# EasyEDA schematic 原理图源工程：MQ系列气体传感器板.json
TITLE: MQ系列气体传感器板; REV: 1.0; Date: 2023-02-20; Sheet: 1/1; Drawn By: leelsp; Company: 工训A413+青禾之道
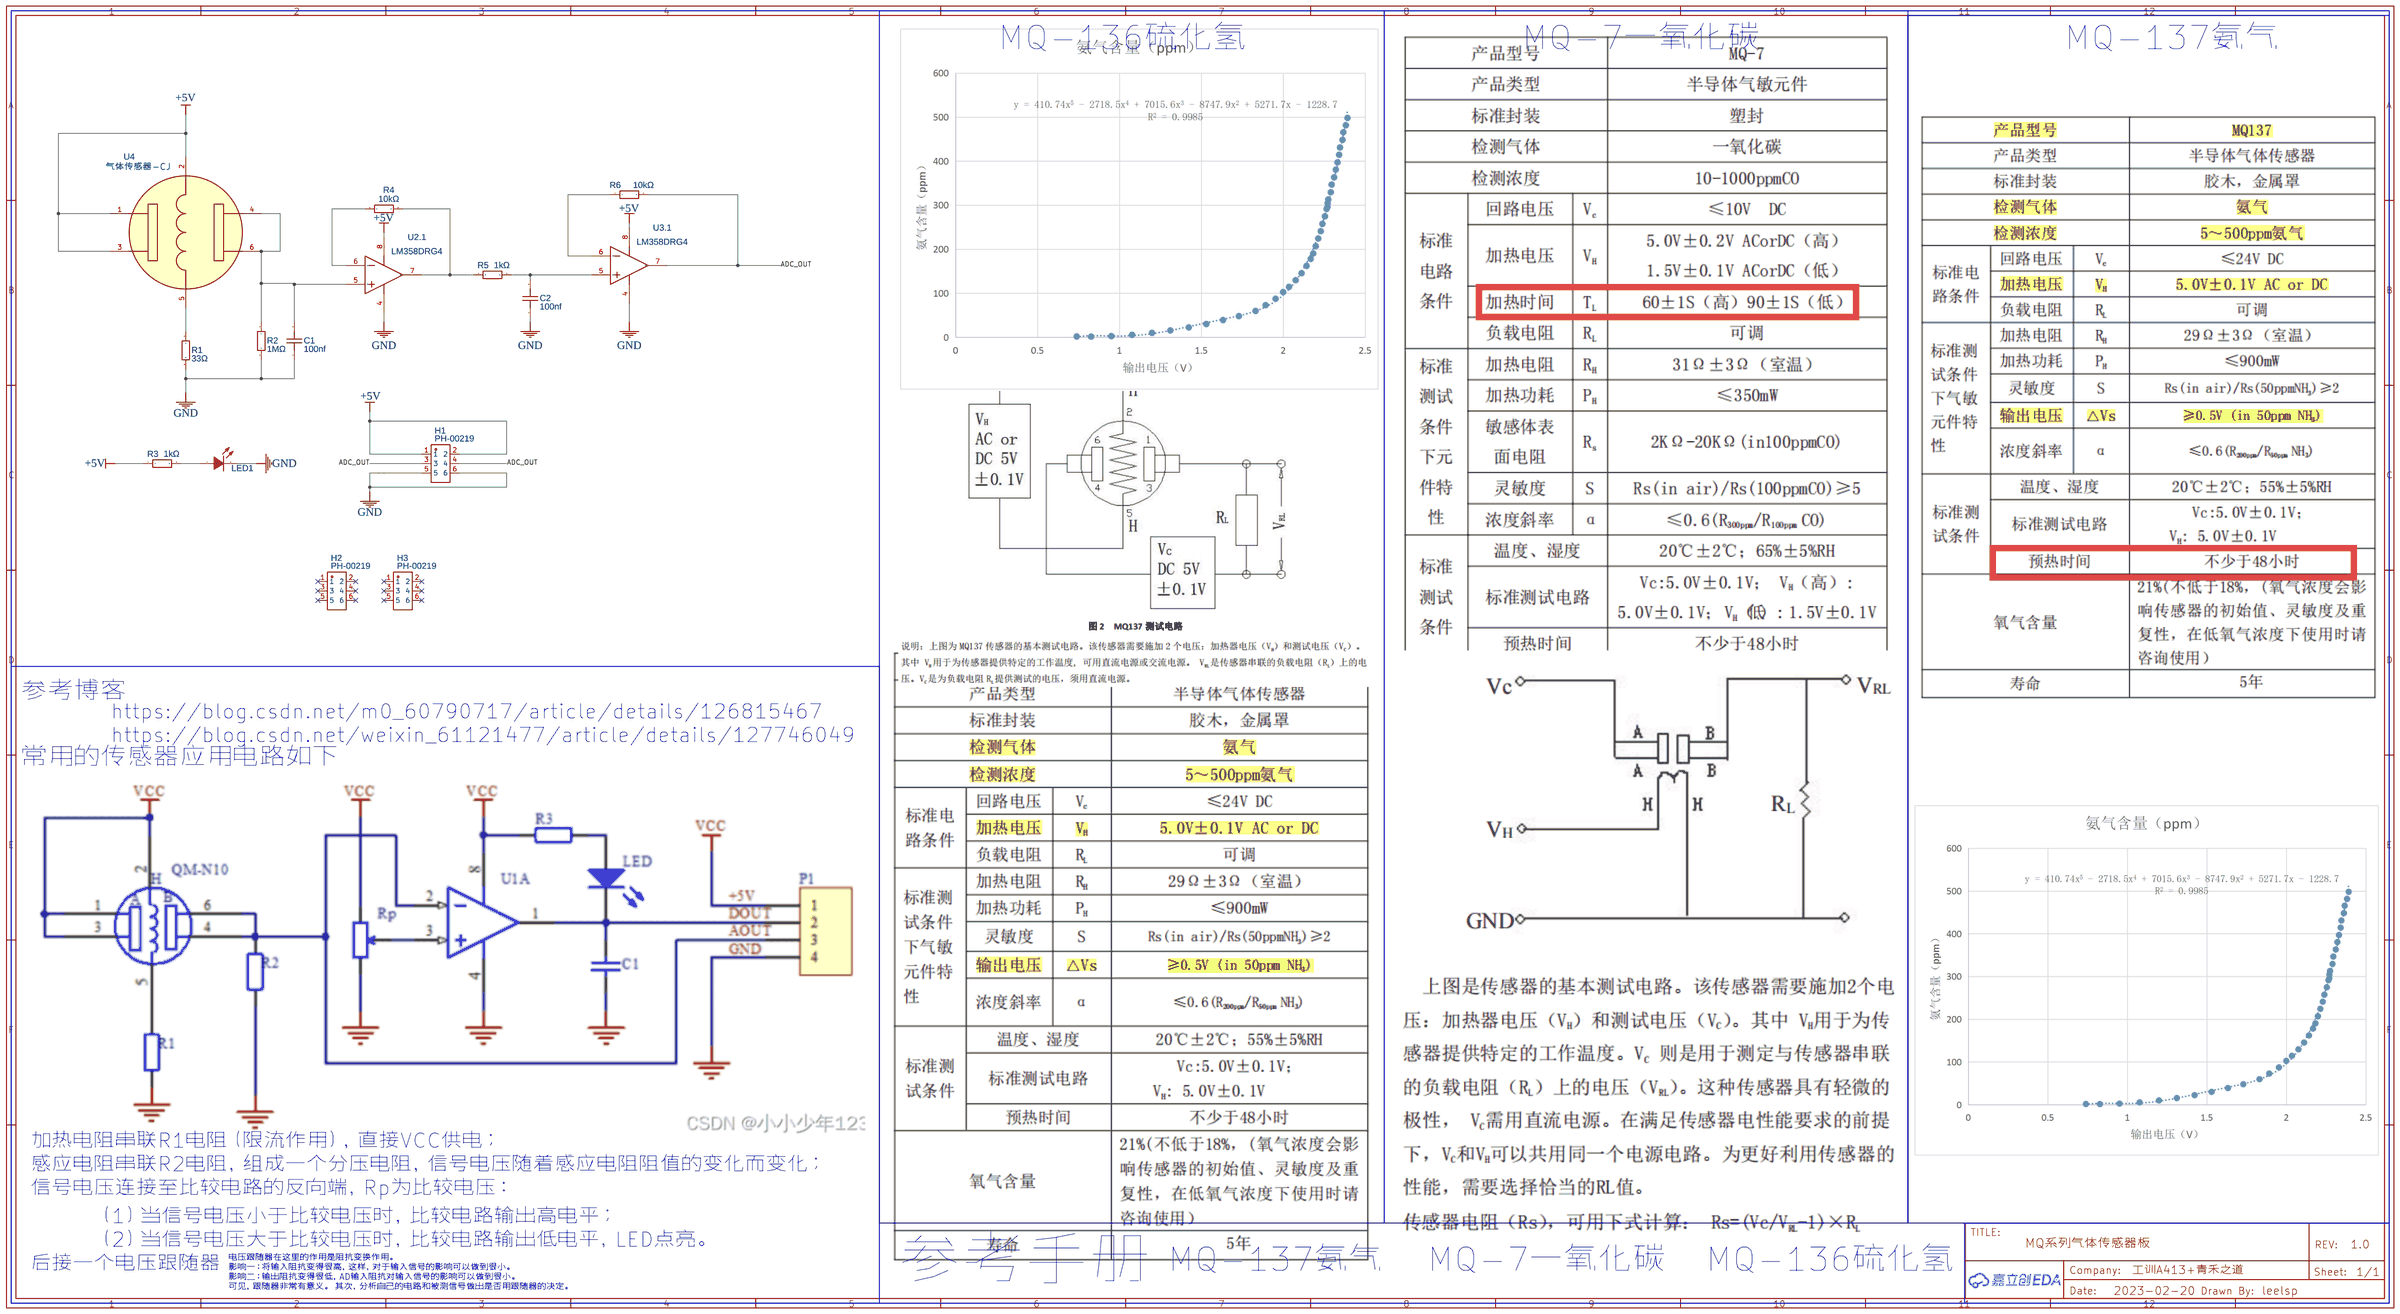
[diagram p0: schematic sheet]

## Parts
C1  100nf  [C0805]
C2  100nf  [C0805]
H1  PH-00219  [HDR-TH_6P-P2.54-V-M-R2-C3-S2.54]
H2  PH-00219  [HDR-TH_6P-P2.54-V-M-R2-C3-S2.54]
H3  PH-00219  [HDR-TH_6P-P2.54-V-M-R2-C3-S2.54]
LED1  FC-3215HRK-620D  [LED-SMD_L3.2-W1.3-RD-EH2.1]
R1  33Ω  [R0805]
R2  1MΩ  [R0805]
R3  1kΩ  [R0805]
R4  10kΩ  [R0603]
R5  1kΩ  [R0805]
R6  10kΩ  [R0603]
U2  LM358DRG4  [SOIC-8_L5.0-W3.2-P1.27-LS8.3-BL]  (section 1)
U3  LM358DRG4  [SOIC-8_L5.0-W3.2-P1.27-LS8.3-BL]  (section 1)
U4  气体传感器-CJ  [MQ2-CJ]

## Library data of the parts
C1 C2 = CC0805JRX7R7BB104: Supplier: LCSC; Supplier Part: C520082; Manufacturer: YAGEO(国巨); Capacitance: 100nF; Contributor: lcsc
H1-H3 = PH-00219: Supplier: LCSC; Supplier Part: C2685145; Manufacturer: Liansheng(连盛); Contributor: LCSC; JLCPCB Part Class: Extended Part
LED1 = FC-3215HRK-620D: Supplier: LCSC; Manufacturer: 国星光电; Manufacturer Part: NCD1206R1; Supplier Part: C84270; JLCPCB Part Class: Extended Part
R1 = 0805W8F330JT5E: Supplier: LCSC; Manufacturer: UNI-ROYAL(厚声); Supplier Part: C17634; Resistance (Ohms): 33; JLCPCB Part Class: Basic Part
R2 = RS-05K105JT: Supplier: LCSC; Manufacturer: FH(风华); Supplier Part: C131391; Resistance (Ohms): 1M; JLCPCB Part Class: Extended Part
R3 R5 = PTFR0805B1K00N9: Supplier: LCSC; Supplier Part: C328437; Manufacturer: RESI(开步睿思）; Resistance (Ohms): 1K; Contributor: LCSC; JLCPCB Part Class: Extended Part
R4 R6 = 0603WAF1002T5E: Supplier: LCSC; Manufacturer: UniOhm; Supplier Part: C25804; Resistance (Ohms): 10K; JLCPCB Part Class: Basic Part
U2 U3 = LM358DRG4: Supplier: LCSC; Supplier Part: C350551; Manufacturer: Texas Instruments; subpart_no: 1; JLCPCB Part Class: Extended Part
U4 = 气体传感器-CJ: Contributor: c..j

## Nets
+5V: H1.1 H1.2 R3.1 U2.8(+V) U3.8(+V) U4.1 U4.2 U4.3
GND: C1.1 C2.1 H1.5 H1.6 LED1.2(K) R1.2 R2.2 U2.4(-V) U3.4(-V)
ADC_OUT: H1.3 H1.4 R6.2 U3.7(OUT 2)
Net-(C1-2): C1.2 R2.1 U2.5(+IN 2) U4.4 U4.6
Net-(C2-2): C2.2 R5.2 U3.5(+IN 2)
Net-(LED1-1): LED1.1(A) R3.2
Net-(R1-1): R1.1 U4.5
Net-(R4-1): R4.1 U2.6(-IN 2)
Net-(R4-2): R4.2 R5.1 U2.7(OUT 2)
Net-(R6-1): R6.1 U3.6(-IN 2)

Not connected (* = marked no-connect by the designer): H2 1* 2* 3* 4* 5* 6*; H3 1* 2* 3* 4* 5* 6*

## Notes on the sheet
- MQ-136硫化氢
- MQ-7一氧化碳
- MQ-137氨气
- 参考博客
- https://blog.csdn.net/m0_60790717/article/details/126815467
- https://blog.csdn.net/weixin_61121477/article/details/127746049
- 常用的传感器应用电路如下
- 加热电阻串联R1电阻（限流作用），直接VCC供电；
- 感应电阻串联R2电阻，组成一个分压电阻，信号电压随着感应电阻阻值的变化而变化；
- 信号电压连接至比较电路的反向端，Rp为比较电压：
- （1）当信号电压小于比较电压时，比较电路输出高电平；
- （2）当信号电压大于比较电压时，比较电路输出低电平，LED点亮。
- 参考手册
- MQ-137氨气
- MQ-7一氧化碳
- MQ-136硫化氢
- 后接一个电压跟随器
- 电压跟随器在这里的作用是阻抗变换作用。
  影响一：将输入阻抗变得很高，这样，对于输入信号的影响可以做到很小。
  影响二：输出阻抗变得很低，AD输入阻抗对输入信号的影响可以做到很小。
  可见，跟随器非常有意义。 其次，分析自己的电路和被测信号做出是否用跟随器的决定。
